# EAGLE design piezo_flasher_v1.1 (EAGLE 7.3.0)
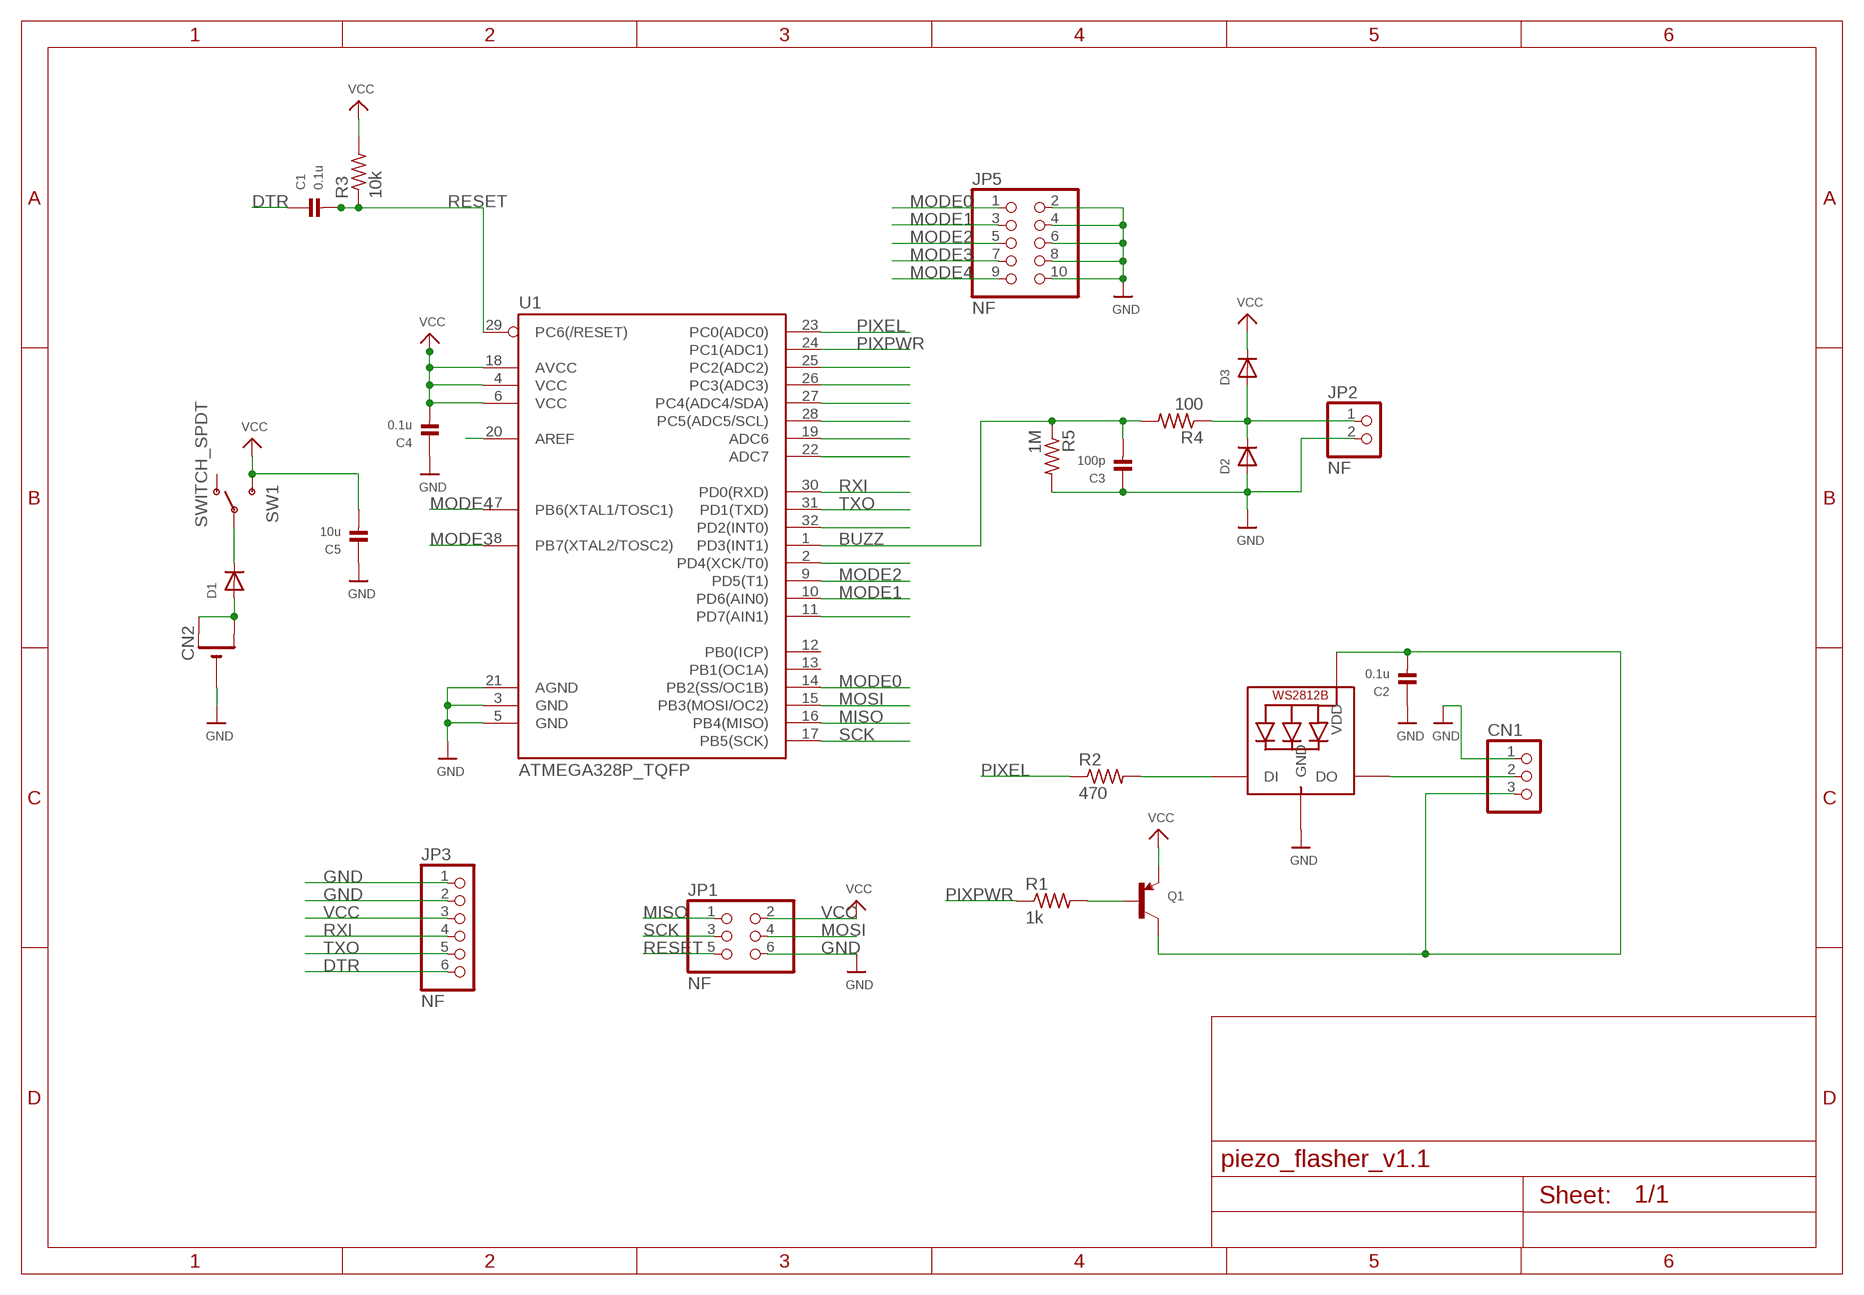
[diagram p0: schematic, sheet 1]

## Parts
C1  0.1u  CAP_CERAMIC0805  [0805]
C2  0.1u  CAP_CERAMIC0805  [0805]
C3  100p  CAP_CERAMIC0805  [0805]
C4  0.1u  CAP_CERAMIC0805  [0805]
C5  10u  CAP_CERAMIC0805  [0805]
CN1  JST_3PIN  [JSTPH3]
CN2  CR2032SMT  [CR2032-SMD]
D1  DIODESOD-323  [SOD-323]
D2  DIODESOD-323  [SOD-323]
D3  DIODESOD-323  [SOD-323]
JP1  NF  HEADER-2X3  [2X03_ROUND_70MIL]
JP2  NF  HEADER-1X2ROUND  [1X02_ROUND]
JP3  NF  HEADER-1X6ROUND  [1X06_ROUND]
JP5  NF  HEADER-2X5  [2X05]
LED1  WS2812B5050  [WS2812B]
Q1  TRANSISTOR_PNPWIDE  [SOT23-WIDE]
R1  1k  R-US_R0805  [R0805]
R2  470  R-US_R0805  [R0805]
R3  10k  R-US_R0805  [R0805]
R4  100  R-US_R0805  [R0805]
R5  1M  R-US_R0805  [R0805]
SW1  SWITCH_SPDT  [KPS-1290]
U1  ATMEGA328P_TQFP  [TQFP32-08]

## Nets
BUZZ: C3.2 R4.2 R5.1 U1.1(PD3(INT1))
DTR: C1.1 JP3.6
GND: C2.1 C3.1 C4.1 C5.1 CN1.1 CN2.- D2.A JP1.6 JP2.2 JP3.1 JP3.2 JP5.2 JP5.4 JP5.6 JP5.8 JP5.10 LED1.3-GND(GND) R5.2 U1.3(GND) U1.5(GND) U1.21(AGND)
MISO: JP1.1 U1.16(PB4(MISO))
MODE0: JP5.1 U1.14(PB2(SS/OC1B))
MODE1: JP5.3 U1.10(PD6(AIN0))
MODE2: JP5.5 U1.9(PD5(T1))
MODE3: JP5.7 U1.8(PB7(XTAL2/TOSC2))
MODE4: JP5.9 U1.7(PB6(XTAL1/TOSC1))
MOSI: JP1.4 U1.15(PB3(MOSI/OC2))
N$1: Q1.1(B) R1.2
N$2: C2.2 CN1.3 LED1.1-VDD(VDD) Q1.3(C)
N$3: LED1.4-DIN(DI) R2.2
N$4: D2.C D3.A JP2.1 R4.1
N$5: CN1.2 LED1.2-DOUT(DO)
N$7: CN2.+$1(+) CN2.+$2(+1) D1.A
N$10: U1.25(PC2(ADC2))
N$11: U1.26(PC3(ADC3))
N$12: D1.C SW1.P
N$15: U1.27(PC4(ADC4/SDA))
N$19: U1.28(PC5(ADC5/SCL))
N$20: U1.19(ADC6)
N$21: U1.22(ADC7)
N$22: U1.32(PD2(INT0))
N$23: U1.2(PD4(XCK/T0))
N$26: U1.11(PD7(AIN1))
N$32: U1.20(AREF)
PIXEL: R2.1 U1.23(PC0(ADC0))
PIXPWR: R1.1 U1.24(PC1(ADC1))
RESET: C1.2 JP1.5 R3.1 U1.29(PC6(/RESET))
RXI: JP3.4 U1.30(PD0(RXD))
SCK: JP1.3 U1.17(PB5(SCK))
TXO: JP3.5 U1.31(PD1(TXD))
VCC: C4.2 C5.2 D3.C JP1.2 JP3.3 Q1.2(E) R3.2 SW1.S U1.4(VCC) U1.6(VCC) U1.18(AVCC)
Unconnected: SW1.O U1.12(PB0(ICP)) U1.13(PB1(OC1A))

## Library data of the parts
C1-C5 = microbuilder:CAP_CERAMIC: Ceramic Capacitors 0402 - 0402 Surface Mount Capacitors 16pF 50V 5% [Digikey: 445-4899-2-ND] 18pF 50V 5% [Digikey: 490-1281-2-ND] 22pF 50V 5% [Digikey: 490-1283-2-ND] 68pF 50V 5% [Digikey: 490-1289-2-ND] 0.1uF 10V 10% [Digikey: 490-1318-2-ND] 1.0uF 6.3V 10% [Digikey: 490-1320-2-ND] 0603 - 0603 Surface Mount Capacitors 16 pF 50V 5% [Digikey: 445-5051-2-ND] 22 pF 50V [Digikey: PCC220ACVTR-ND] 33 pF 50V 5% [Digikey: 490-1415-1-ND] 56pF 50V 5% [Digikey: 490-1421-1-ND] 220pF 50V 5% [Digikey: 445-1285-1-ND] 680 pF 50V 2200 pF 50V 5% C0G [Digikey: 445-1297-1-ND] 5600 pF 100V 5% X7R [Digikey: 478-3711-1-ND] 0.1 µF 25V 10% [Digikey: PCC2277TR-ND] 0.22 µF 16V 10% X7R [Digikey: 445-1318-1-ND] 1.0 µF 25V 10% [Digikey: 445-5146-2-ND] 0603 - RF Specific 3pF 250V +/-0.1pF RF [Digikey: 712-1347-1-ND] 18 pF 250V 5% [Digikey: 478-3505-1-ND or 712-1322-1-ND] 56 pF 250V 5% C0G RF [Digikey: 490-4867-1-ND] 68 pF 250V RF [Digikey: 490-4868-1-ND] 0805 - 0805 Surface Mount Capacitors 220 pF 250V 2% RF Ceramic Capacitor [Digikey: 712-1398-1-ND] 1000 pF 50V 2% NP0 Ceramic Capacitor [Digikey: 478-3760-1-ND] 0.1 µF 25V 10% Ceramic Capacitor [Digikey: PCC1828TR-ND] 1.0 µF 16V 10% Ceramic Capacitor[Digikey: 490-1691-2-ND] 10.0 µF 10V 10% Ceramic Capacitor[Digikey: 709-1228-1-ND] 10.0 uF 16V 10% Ceramic Capacitor [Digikey: 478-5165-2-ND] 47 uF 6.3V 20% Ceramic Capacitor [Digikey: 587-1779-1-ND or 399-5506-1-ND] 1206 - 1206 Surface Mount Capacitors 47uF 10V 20% Ceramic Capacitor [Digikey: 490-5528-1-ND or 399-5508-1-ND or 445-6010-1-ND] 100uF 6.3V -20%, +80% Y5V Ceramic Capacitor (Digikey: 490-4512-1-ND, Mouser: 81-GRM31CF50J107ZE1L)
CN1 = adafruit:JST_3PIN
CN2 = adafruit:CR2032
D1-D3 = microbuilder:DIODE: Diode SMA Model Volts Amps Type Vf Vr Digikey # Notes SSA34-E3 40V 3A Schottky 480mV @ 3A 200uA @ 40V SSA34-E3/61TGITR-ND CDBA120-G 20V 1A Schottky 500mV @ 1A 500uA @ 20V 641-1014-6-ND REEL MBRA210 10V 2A Schottky 350mV @ 2A 700uA @ 10V MBRA210LT3 SOD-123 Model Volts Amps Type Vf Vr Order # Notes BAT54T1G 30V 200mA Schottky 800mV @ 200mA 2uA @ 25V BAT54T1GOSTR-ND B0530W 30V 500mA Schottky 430mV @ 500mA 130uA @ 30V B0530W-FDICT-ND REEL MBR120 1A 20V Schottky 340mV @ 1A MBR120VLSFT1GOSCT-ND SOD-323 Model Volts Amps Type Vf Vr Order # Notes PMEG2005EJ 20V 500mA Schottky 355mV @ 500mA 568-4110-1-ND ZLLS410 10V 570mA Schottky 380mV @ 570mA ZLLS410CT-ND 1N4148WS 75V 150mA Silicon/Simple 1V 1N4148WSFSCT-ND REEL SOD-523 Model Volts Amps Type Vf Vr Order # Notes BAT54XV2 30V 200mA Schottky 0.8V @ 100mA BAT54XV2CT-ND TB751S 30V 30mA Schottky RB751S-40TE61CT-ND SOT23-R/W (R = Solder Paste/Reflow Ovens, W = Hand-Soldering) Model Volts Amps Type Vf Vr Order # Notes BAT54FILM 40V 300mA Schottky 497-7162-1-ND
JP1 = microbuilder:HEADER-2X3: PIN HEADER
JP2 = microbuilder:HEADER-1X2: PIN HEADER
JP3 = microbuilder:HEADER-1X6: PIN HEADER
JP5 = microbuilder:HEADER-2X5: PIN HEADER
LED1 = adafruit:WS2812B
Q1 = microbuilder:TRANSISTOR_PNP: PNP Transistor Transistor (PNP) 800mA 60V, 1.6V VCE @ 500mA [Digikey: MMBT2907AFSTR-ND] Transistor (PNP) Low Sat - 1.5A 20V, 260mV VCE @ 400mA [Digikey: ZXTP25020DFLTR-ND] SOT23-R - SOT23 footprint optimised for use with solder paste and reflow ovens. SOT23-W - SOT23 footprint optimised for hand-soldering (larger pads).
R1-R5 = adafruit:R-US_: RESISTOR, American symbol
SW1 = SparkFun-Electromechanical:SWITCH_SPDT: SWCH-10651 Side-actuated SPDT slide switch, as used on the Arduino Pro; PROD_ID: SWCH-10651
U1 = SparkFun-DigitalIC:ATMEGA328P_TQFP; PROD_ID: IC-09069

## Board
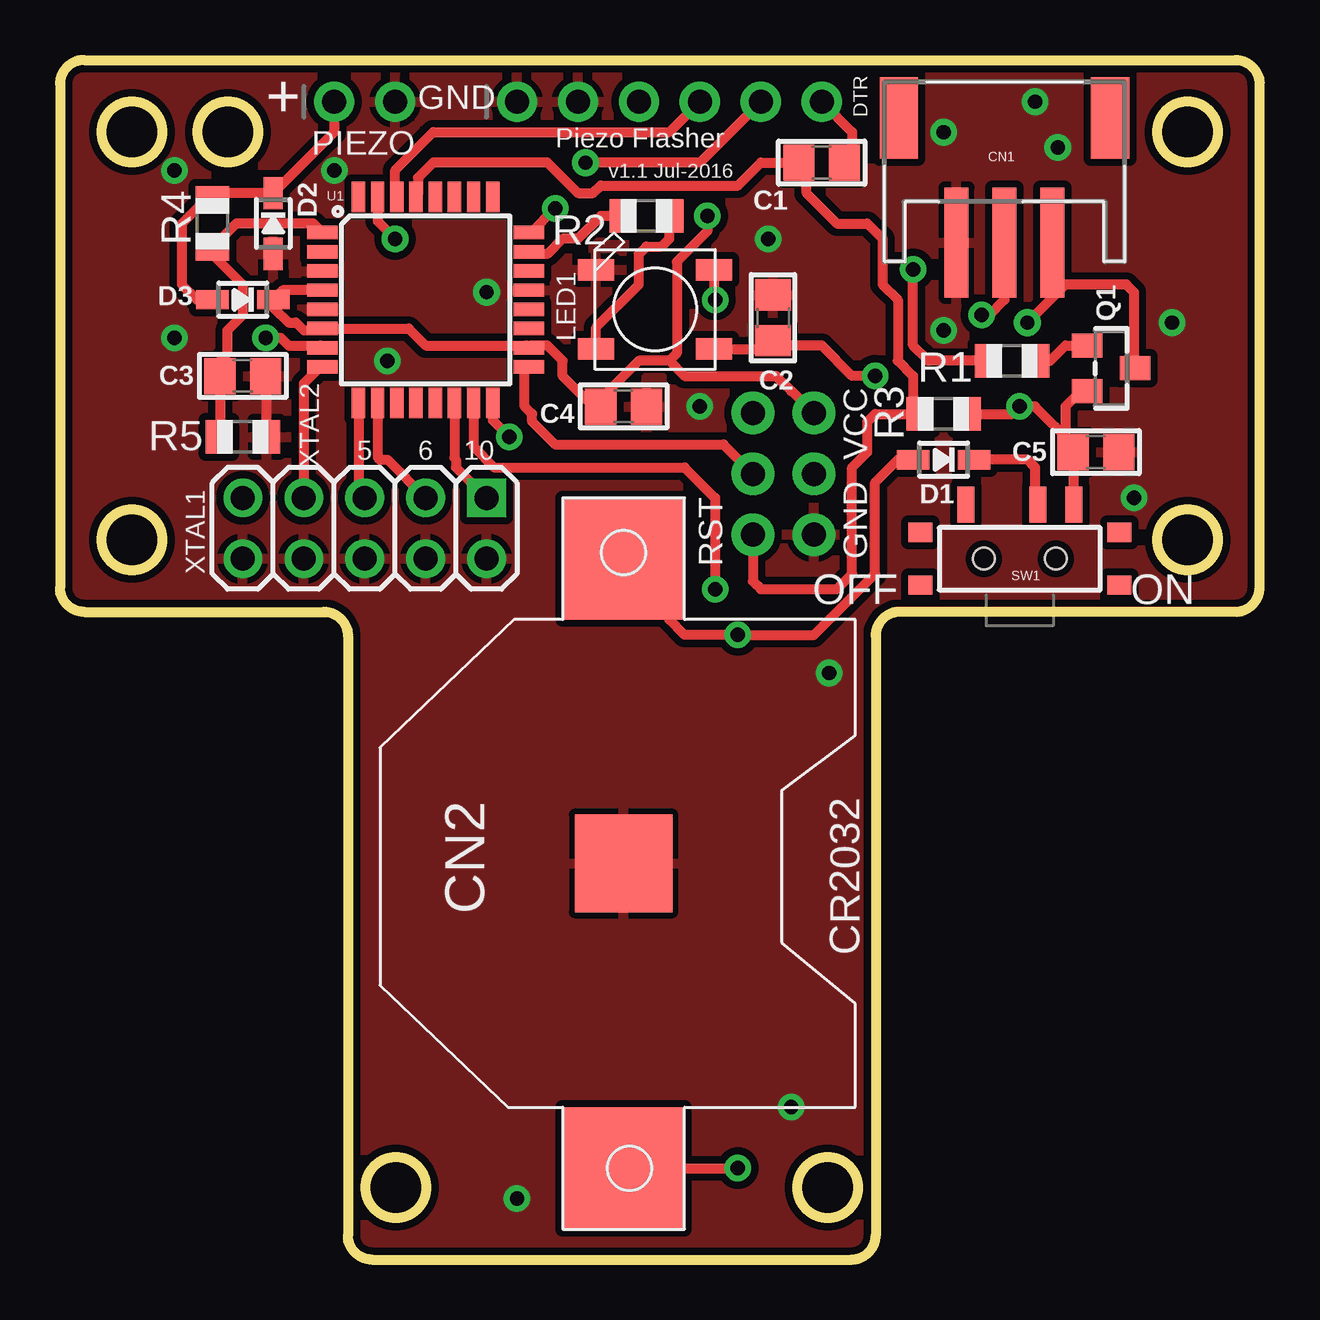
[diagram p1: board, top side]
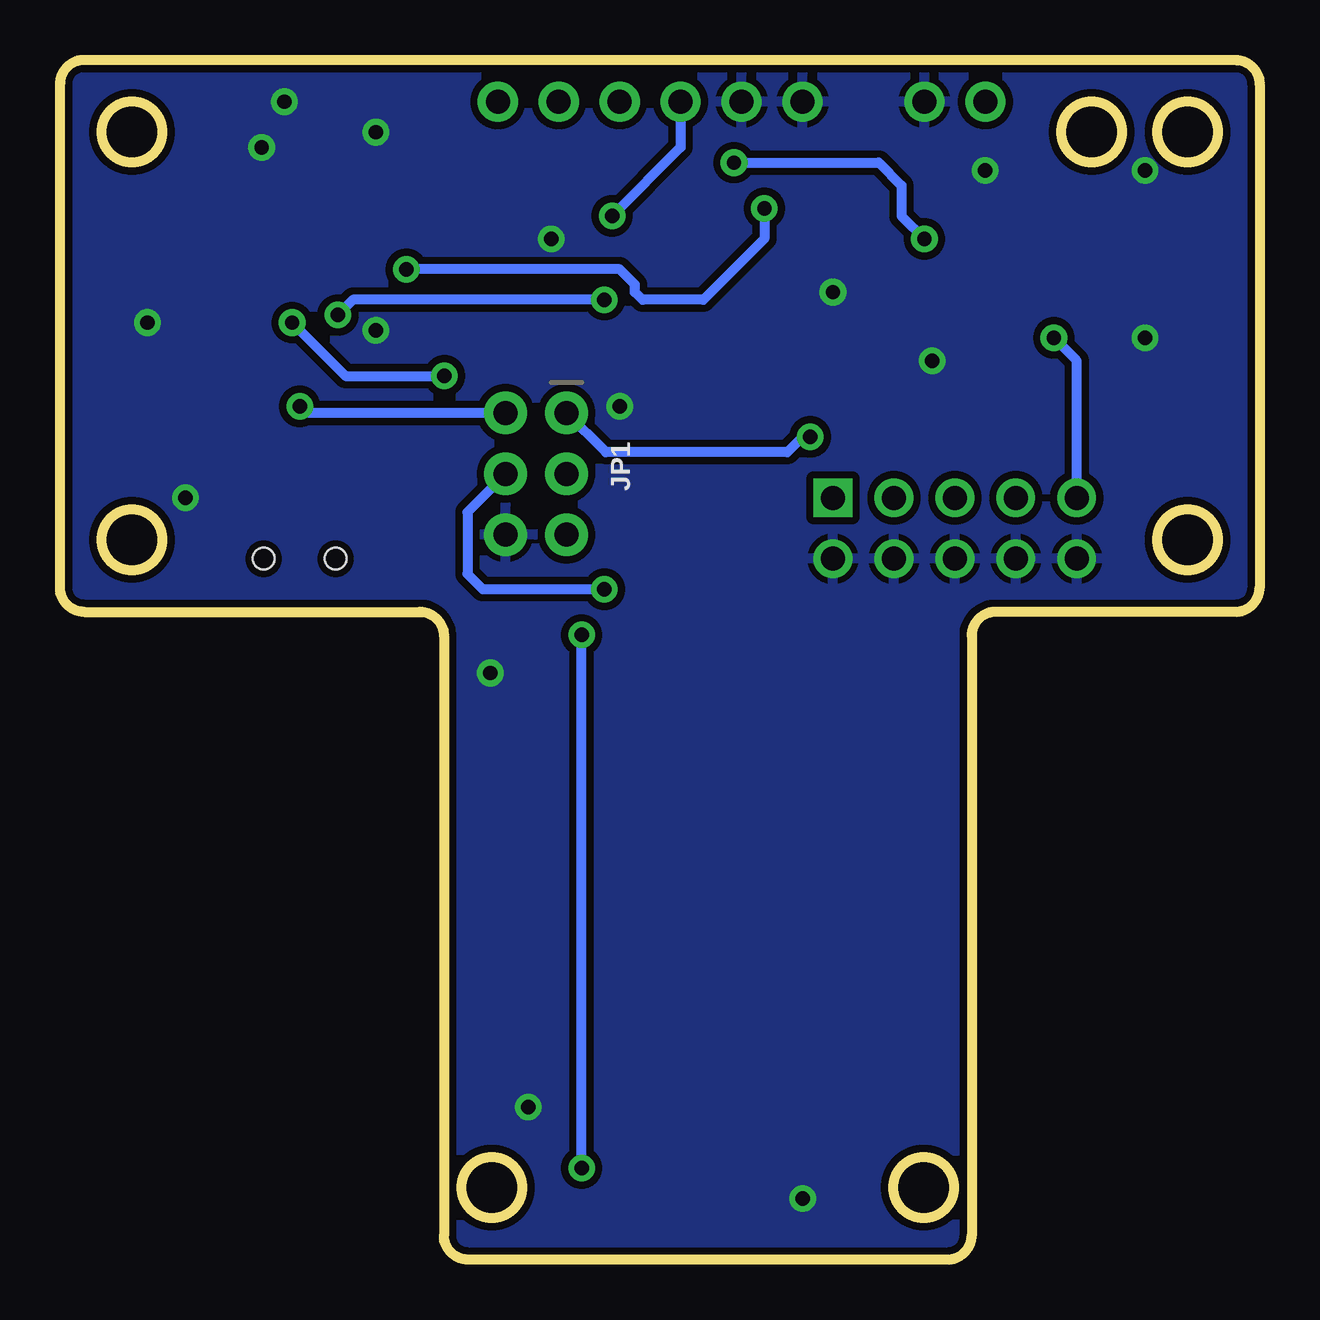
[diagram p2: board, bottom side, seen from below]

Size 50 x 50 mm. Coordinates in mm from the lower left corner, seen from the top.
Outline: 13,0 33,0 arc90 34,1 34,26 arc-90 35,27 49,27 arc90 50,28 50,49 arc90 49,50 1,50 arc90 0,49 0,28 arc90 1,27 11,27 arc-90 12,26 12,1 arc90 13,0
Outline: circle at 14,3 radius 1.27
Outline: circle at 32,3 radius 1.27
Outline: circle at 47,30 radius 1.27
Outline: circle at 47,47 radius 1.27
Outline: circle at 3,47 radius 1.27
Outline: circle at 3,30 radius 1.27
Outline: circle at 7,47 radius 1.27
Copper layers (1*16): Top 0.035mm / dielectric 1.5mm / Bottom 0.035mm
Design rules "SparkFun-2-layer": minimum track width 7mil, minimum drill 15mil, track to track 8mil, track to pad 8mil, pad to pad 8mil, via to via 8mil, smd to smd 8mil, copper to edge 8mil, drill to drill 8mil, minimum pad ring 12mil, minimum via ring 10mil, stop-mask expansion 4mil, vias tented up to drill 20mil, thermal gap 10mil

### Footprints (pad centres in the part's own frame; a part is rotated, then mirrored left to right if it is on the bottom)
0805 = smd 1.3 x 1.5: 1 -0.95,0; 2 0.95,0
JSTPH3 = smd 1 x 4.6: 1 -2,-2.7; 2 0,-2.7; 3 2,-2.7 | smd 1.6 x 3.4: NC1 -4.4,2.5; NC2 4.4,2.5
CR2032-SMD = smd 5.08 x 5.08: +$1 -12.7,0; +$2 12.7,0 | smd 4.064 x 4.064: - 0,0
SOD-323 = smd 1.35 x 0.8: A 1.27,0; C -1.27,0
2X03_ROUND_70MIL = drill 1 pad 1.778: 1 -2.54,1.27; 2 -2.54,-1.27; 3 0,1.27; 4 0,-1.27; 5 2.54,1.27; 6 2.54,-1.27
1X02_ROUND = drill 1 pad 1.676: 1 -1.27,0; 2 1.27,0
1X06_ROUND = drill 1 pad 1.676: 1 -6.35,0; 2 -3.81,0; 3 -1.27,0; 4 1.27,0; 5 3.81,0; 6 6.35,0
2X05 = drill 1 square: 1 -5.08,-1.27 | drill 1: 2 -5.08,1.27; 3 -2.54,-1.27; 4 -2.54,1.27; 5 0,-1.27; 6 0,1.27; 7 2.54,-1.27; 8 2.54,1.27; 9 5.08,-1.27; 10 5.08,1.27
WS2812B = smd 1.5 x 0.9: 1-VDD 2.45,-1.65; 2-DOUT 2.45,1.65; 3-GND -2.45,1.65; 4-DIN -2.45,-1.65
SOT23-WIDE = smd 1 x 1.27: 1 -0.95,-1; 2 0.95,-1; 3 0,1
R0805 = smd 1.1 x 1.4: 1 -1,0; 2 1,0
KPS-1290 = smd 0.7 x 1.5: O -2.25,2.25; P 0.75,2.25; S 2.25,2.25 | smd 1 x 0.8: P$1 -4.15,1.1; P$2 -4.15,-1.1; P$3 4.15,-1.1; P$4 4.15,1.1 | hole 0.9: -1.5,0; 1.5,0
TQFP32-08 = smd 1.27 x 0.559: 1 -4.293,2.8; 2 -4.293,2; 3 -4.293,1.2; 4 -4.293,0.4; 5 -4.293,-0.4; 6 -4.293,-1.2; 7 -4.293,-2; 8 -4.293,-2.8; 17 4.293,-2.8; 18 4.293,-2; 19 4.293,-1.2; 20 4.293,-0.4; 21 4.293,0.4; 22 4.293,1.2; 23 4.293,2; 24 4.293,2.8 | smd 0.559 x 1.27: 9 -2.8,-4.293; 10 -2,-4.293; 11 -1.2,-4.293; 12 -0.4,-4.293; 13 0.4,-4.293; 14 1.2,-4.293; 15 2,-4.293; 16 2.8,-4.293; 25 2.8,4.293; 26 2,4.293; 27 1.2,4.293; 28 0.4,4.293; 29 -0.4,4.293; 30 -1.2,4.293; 31 -2,4.293; 32 -2.8,4.293

### Placement (x,y rotation side)
C1  31.75,45.72 180 top
C2  29.72,39.25 270 top
C3  7.62,36.83 180 top
C4  23.5,35.56 180 top
C5  43.18,33.66 180 top
CN1  39.37,45.09 0 top
CN2  23.5,16.51 270 top
D1  36.83,33.34 180 top
D2  8.89,43.18 270 top
D3  7.62,40.01 180 top
JP1  30.16,32.75 270 bottom
JP2  12.7,48.26 0 top
JP3  25.4,48.26 0 top
JP5  12.7,30.48 180 top
LED1  24.8,39.6 0 top
Q1  43.81,37.15 270 top
R1  39.69,37.47 0 top
R2  24.45,43.5 0 top
R3  36.83,35.24 0 top
R4  6.35,43.18 270 top
R5  7.62,34.29 0 top
SW1  40.01,29.21 0 top
U1  15.24,40.01 0 top

### Tracks (layer width: path | path; a pad name or v marks a point on that pad's centre or on a via)
BUZZ
  Top 0.406: R5.1 6.67,34.34 C3.2 6.67,37.47 6.99,37.78 6.99,38.73 7.62,39.37 7.62,40.64 6.35,41.91 R4.2 7.35,43.18 10.57,43.18 U1.1
DTR
  Top 0.406: JP3.6 33.02,46.99 33.02,46.04 C1.1
GND  (via drill 0.6)
  Top 0.406: R5.2 8.62,36.78 C3.1
  other vias: 29.53,42.55 13.65,37.47 36.83,46.99 46.35,39.05 26.67,35.56 11.43,45.4 41.59,46.35 44.77,31.75 36.83,38.73 19.05,2.54 30.48,6.35 4.76,45.4 4.76,38.42 40.64,48.26 32.07,24.45 17.78,40.32
  pour Top (isolate 0.305): 0,50 50,50 50,27 34,27 34,0 12,0 12,27 0,27
  pour Bottom (isolate 0.305): 0,50 50,50 50,27 34,27 34,0 12,0 12,27 0,27
MISO  (via drill 0.6)
  Top 0.406: U1.16 18.04,34.98 v18.73,34.29
  Bottom 0.406: v18.73,34.29 19.05,34.29 19.68,33.66 27.25,33.66 JP1.1
MODE0
  Top 0.406: U1.14 16.44,33.41 16.51,33.34 16.51,33.02 JP5.1
MODE1
  Top 0.406: U1.10 13.24,33.43 13.34,33.34 13.65,33.34 JP5.3
MODE2
  Top 0.406: U1.9 12.44,32.01 JP5.5
MODE3
  Top 0.406: U1.8 10.85,37.2 10.16,36.51 JP5.7
MODE4  (via drill 0.6)
  Top 0.406: v8.57,38.42 9.21,38.42 9.53,38.1 10.85,38.1 U1.7
  Bottom 0.406: JP5.9 7.62,37.47 v8.57,38.42
MOSI  (via drill 0.6)
  Top 0.406: v27.3,27.94 27.3,31.75 26.04,33.02 18.1,33.02 17.24,33.88 U1.15
  Bottom 0.406: v27.3,27.94 32.38,27.94 33.02,28.57 33.02,31.16 JP1.4
N$1
  Top 0.406: R1.2 41.27,37.47 41.91,38.1 Q1.1
N$2  (via drill 0.6)
  Top 0.406: Q1.3 44.77,37.2 44.77,40.32 44.45,40.64 41.91,40.64 41.37,40.1 | CN1.3 41.37,40.1 | 41.37,40.1 v40.32,39.05 | LED1.1-VDD 29.37,37.95 C2.2 29.93,38.1 31.75,38.1 33.02,36.83 v33.97,36.83
  Bottom 0.406: v40.32,39.05 38.1,36.83 v33.97,36.83
N$3
  Top 0.406: LED1.4-DIN 22.35,38.86 24.13,40.64 24.13,41.91 24.45,42.23 25.08,42.23 25.4,42.55 25.4,43.45 R2.2
N$4
  Top 0.406: JP2.1 11.43,46.99 D2.C 6.62,44.45 R4.1 6.08,44.18 5.08,43.18 5.08,40.64 5.71,40.01 D3.A
N$5  (via drill 0.6)
  Top 0.406: LED1.2-DOUT 27.25,40.06 v27.3,40.01 | v38.42,39.37 38.73,39.37 39.37,40.01 CN1.2
  Bottom 0.406: v27.3,40.01 37.78,40.01 v38.42,39.37
N$7  (via drill 0.6)
  Top 0.406: CN2.+$1 24.13,29.21 25.4,27.94 25.4,26.67 26.04,26.04 v28.26,26.04 31.43,26.04 33.97,28.57 33.97,32.38 34.92,33.34 D1.A | CN2.+$2 v28.26,3.81
  Bottom 0.406: v28.26,3.81 v28.26,26.04
N$12
  Top 0.406: SW1.P 40.64,31.57 40.64,33.02 40.32,33.34 D1.C
PIXEL
  Top 0.406: R2.1 22.54,43.5 21.59,42.55 20.95,42.55 20.32,41.91 19.63,41.91 U1.23
PIXPWR  (via drill 0.6)
  Top 0.406: U1.24 19.63,42.8 v20.64,43.81 | R1.1 36.2,37.47 35.56,38.1 v35.56,41.27
  Bottom 0.406: v20.64,43.81 20.64,42.55 23.18,40.01 25.72,40.01 26.04,40.32 26.04,40.64 26.67,41.27 v35.56,41.27
RESET
  Top 0.406: 30.48,45.4 C1.2 | JP1.5 28.89,28.27 29.21,27.94 32.38,27.94 33.02,28.57 33.02,33.02 33.66,33.66 33.66,34.92 33.97,35.24 R3.1 35.56,35.51 35.56,36.83 34.92,37.47 34.92,40.01 34.29,40.64 34.29,42.55 33.66,43.18 32.38,43.18 31.11,44.45 31.11,45.41 C1.2 | C1.2 29.21,45.72 28.26,44.77 22.54,44.77 22.23,44.45 21.59,44.45 20.32,45.72 15.56,45.72 14.92,45.09 14.92,44.38 U1.29
RXI
  Top 0.406: JP3.4 25.4,46.99 15.56,46.99 13.97,45.4 13.97,44.37 U1.30
SCK
  Top 0.406: U1.17 19.37,37.04 19.37,35.56 19.68,35.24 19.68,34.92 20.64,33.97 27.66,33.97 JP1.3
TXO  (via drill 0.6)
  Top 0.406: U1.31 13.24,43.27 v13.97,42.55 | JP3.5 26.67,45.72 v21.91,45.72
  Bottom 0.406: v13.97,42.55 14.92,43.5 14.92,44.77 15.88,45.72 v21.91,45.72
VCC  (via drill 0.6)
  Top 0.406: SW1.S 42.26,33.02 | 42.26,33.02 42.26,33.63 C5.2 42.23,33.97 40.64,35.56 v40.01,35.56 39.69,35.24 R3.2 | Q1.2 42.55,36.2 41.91,35.56 41.91,33.37 42.26,33.02 | U1.4 9.29,40.41 D3.C 8.89,39.69 9.53,39.05 9.84,39.05 10.16,38.73 10.88,38.73 U1.6 14.54,38.8 15.24,38.1 19.44,38.1 U1.18 19.63,38.1 20.32,38.1 20.95,37.47 20.95,36.83 22.23,35.56 C4.2 22.55,35.88 24.13,37.47 25.4,37.47 | 25.4,37.47 26.04,36.83 29.84,36.83 30.48,36.2 30.52,36.2 JP1.2 | v26.99,43.5 26.99,42.86 25.72,41.59 25.72,37.78 25.4,37.47
  Bottom 0.406: JP1.2 39.73,35.29 v40.01,35.56 | JP3.3 24.13,46.35 v26.99,43.5

### Text on the board
tPlace: Piezo Flasher | v1.1 Jul-2016 | OFF | ON | CR2032
tNames: + | GND | DTR | PIEZO | XTAL2 | 5 | 6 | 10 | VCC | XTAL1 | RST | GND
200bmp: /Users/shunya/Documents/FrriteKun/dojo_logo_bw2.bmp
225bmp: /Users/shunya/Documents/FrriteKun/dojo_logo_bw4.bmp